# EAGLE board Axion (EAGLE 7.7.0)
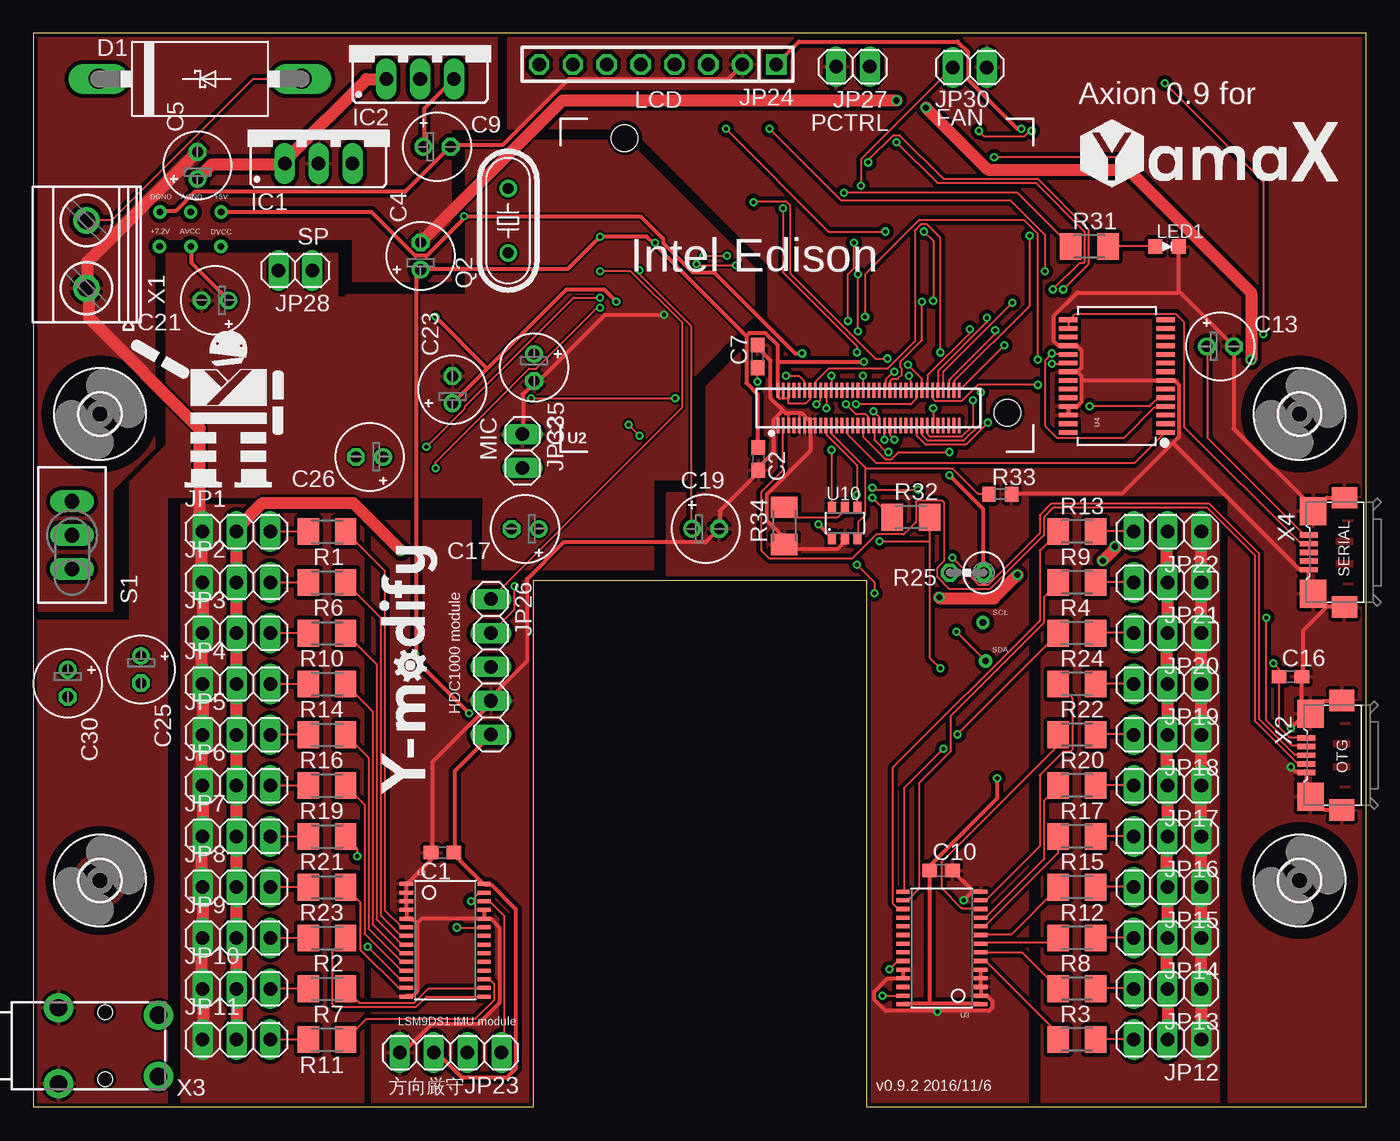
[diagram p1: board, top side]
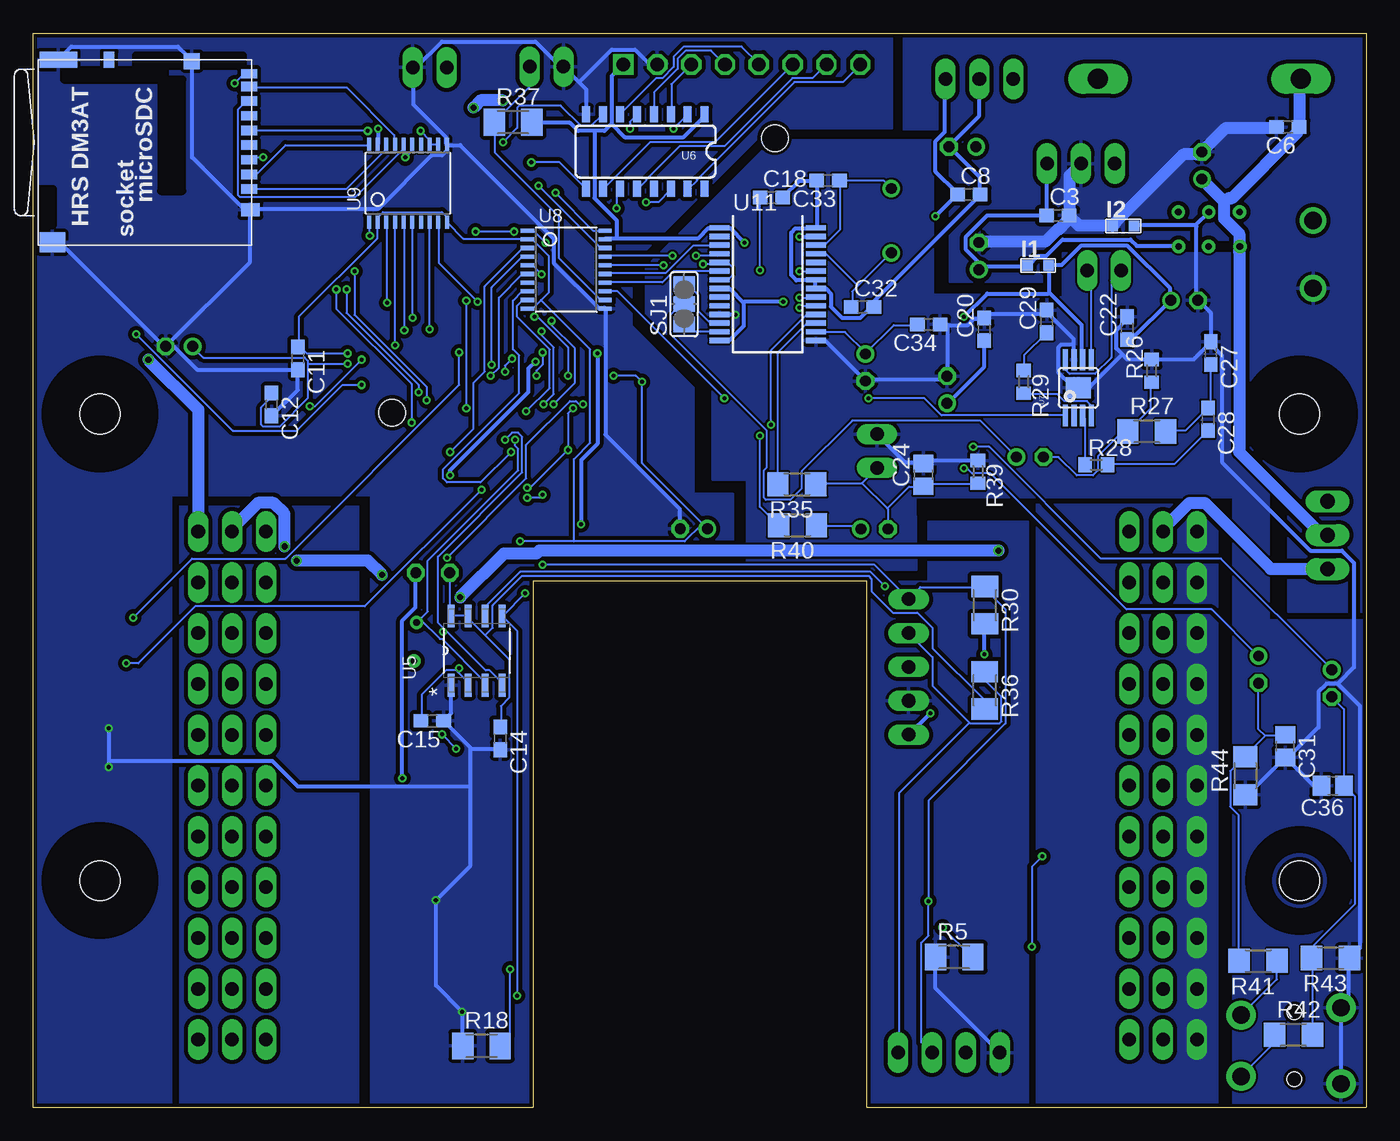
[diagram p2: board, bottom side, seen from below]

Size 100 x 80.55 mm. Coordinates in mm from the lower left corner, seen from the top.
Outline: 100,0 100,80.55 0,80.55 0,0 37.5,0 37.5,39.5 62.5,39.5 62.5,0 100,0
Copper layers (1*16): Top 0.035mm / dielectric 1.5mm / Bottom 0.035mm
Design rules "ssci_SeeedStudio_2layer_DRU_no_angle": minimum track width 6mil, minimum drill 12mil, track to track 6mil, track to pad 6mil, pad to pad 6mil, via to via 6mil, smd to smd 0mil, copper to edge 10mil, drill to drill 10mil, minimum pad ring 10mil, minimum via ring 6mil, stop-mask expansion 2mil, vias tented up to drill 25mil, thermal gap 10mil
Net classes: 1 motorpower: width 0.914 mm, drill 0.457 mm; 2 power: width 0.305 mm, drill 0.152 mm

## Footprints (pad centres in the part's own frame; a part is rotated, then mirrored left to right if it is on the bottom)
C1608 = smd 1.1 x 1: 1 -0.85,0; 2 0.85,0
E2-5 = drill 0.813 pad 1.27: + -1.016,0 | drill 0.813 pad 1.27 octagon: - 1.016,0
C0805 = smd 1.3 x 1.5: 1 -0.85,0; 2 0.85,0
DO201T15 = drill 1.499 long: A 7.62,0; C -7.62,0
3,0 = hole 3: 0,0
1608(1.6*0.8MM) = smd 0.8 x 0.8: P$3 -0.8,0; P$4 0.8,0
78XXS = drill 1.016 long: GND 0,-2.54; IN -2.54,-2.54; OUT 2.54,-2.54
1X03 = drill 1.016 long: 1 -2.54,0; 2 0,0; 3 2.54,0
1X04 = drill 1.016 long: 1 -3.81,0; 2 -1.27,0; 3 1.27,0; 4 3.81,0
1X08 = drill 1.016 square: 1 -8.89,0 | drill 1.016 octagon: 2 -6.35,0; 3 -3.81,0; 4 -1.27,0; 5 1.27,0; 6 3.81,0; 7 6.35,0; 8 8.89,0
DM3AT-SF-PEJ = smd 0.7 x 1.2: 1 0,0.6; 2 -1.1,0.6; 3 -2.2,0.6; 4 -3.3,0.6; 5 -4.4,0.6; 6 -5.5,0.6; 7 -6.6,0.6; 8 -7.7,0.6; CC1 -8.65,0.6 | smd 1.2 x 2.8: CASE1 -9.7,-13.7 | smd 1.5 x 1.9: CASE2 4,-14.15 | smd 1 x 1.4: CASE3 1.55,0.7 | smd 1.2 x 1.2: CASE4 -9.6,-3.7 | smd 1.2 x 0.8: CC2 -9.7,-9.9
1X05 = drill 1.016 long: 1 -5.08,0; 2 -2.54,0; 3 0,0; 4 2.54,0; 5 5.08,0
1X02 = drill 1.016 long: 1 -1.27,0; 2 1.27,0
LED1608 = smd 1.05 x 1.08: A -0.875,0; K 0.875,0
HC49/S = drill 0.813: 1 -2.413,0; 2 2.413,0
M1206 = smd 1.6 x 2: 1 -1.4,0; 2 1.4,0
0309V = drill 0.813 octagon: 1 -1.27,0; 2 1.27,0
R0603 = smd 1 x 1.1: 1 -0.85,0; 2 0.85,0
R1206 = smd 1.6 x 1.803: 1 -1.422,0; 2 1.422,0
TL3XPO = drill 1.1 pad 1.422 long: 1 -2.54,0; 2 0,0; 3 2.54,0
SJ_2 = smd 1.168 x 1.6: 1 -1.524,0; 2 0,0; 3 1.524,0
ROUND-AUTO-0.5 = drill 0.5: TP 0,0
TSSOP28 = smd 0.305 x 0.991: 1 -4.225,-2.918; 2 -3.575,-2.918; 3 -2.925,-2.918; 4 -2.275,-2.918; 5 -1.625,-2.918; 6 -0.975,-2.918; 7 -0.325,-2.918; 8 0.325,-2.918; 9 0.975,-2.918; 10 1.625,-2.918; 11 2.275,-2.918; 12 2.925,-2.918; 13 3.575,-2.918; 14 4.225,-2.918; 15 4.225,2.918; 16 3.575,2.918; 17 2.925,2.918; 18 2.275,2.918; 19 1.625,2.918; 20 0.975,2.918; 21 0.325,2.918; 22 -0.325,2.918; 23 -0.975,2.918; 24 -1.625,2.918; 25 -2.275,2.918; 26 -2.925,2.918; 27 -3.575,2.918; 28 -4.225,2.918
EDISON_DAUGHTER = smd 1.14 x 0.2: 1 1.98,19.17; 2 4.62,19.17; 3 1.98,18.77; 4 4.62,18.77; 5 1.98,18.37; 6 4.62,18.37; 7 1.98,17.97; 8 4.62,17.97; 9 1.98,17.57; 10 4.62,17.57; 11 1.98,17.17; 12 4.62,17.17; 13 1.98,16.77; 14 4.62,16.77; 15 1.98,16.37; 16 4.62,16.37; 17 1.98,15.97; 18 4.62,15.97; 19 1.98,15.57; 20 4.62,15.57; 21 1.98,15.17; 22 4.62,15.17; 23 1.98,14.77; 24 4.62,14.77; 25 1.98,14.37; 26 4.62,14.37; 27 1.98,13.97; 28 4.62,13.97; 29 1.98,13.57; 30 4.62,13.57; 31 1.98,13.17; 32 4.62,13.17; 33 1.98,12.77; 34 4.62,12.77; 35 1.98,12.37; 36 4.62,12.37; 37 1.98,11.97; 38 4.62,11.97; 39 1.98,11.57; 40 4.62,11.57; 41 1.98,11.17; 42 4.62,11.17; 43 1.98,10.77; 44 4.62,10.77; 45 1.98,10.37; 46 4.62,10.37; 47 1.98,9.97; 48 4.62,9.97; 49 1.98,9.57; 50 4.62,9.57; 51 1.98,9.17; 52 4.62,9.17; 53 1.98,8.77; 54 4.62,8.77; 55 1.98,8.37; 56 4.62,8.37; 57 1.98,7.97; 58 4.62,7.97; 59 1.98,7.57; 60 4.62,7.57; 61 1.98,7.17; 62 4.62,7.17; 63 1.98,6.77; 64 4.62,6.77; 65 1.98,6.37; 66 4.62,6.37; 67 1.98,5.97; 68 4.62,5.97; 69 1.98,5.57; 70 4.62,5.57 | hole 2: 23.53,30.67; 2.93,1.98
SSOP28DB = smd 0.348 x 1.397: 1 -4.225,-3.656; 2 -3.575,-3.656; 3 -2.925,-3.656; 4 -2.275,-3.656; 5 -1.625,-3.656; 6 -0.975,-3.656; 7 -0.325,-3.656; 8 0.325,-3.656; 9 0.975,-3.656; 10 1.625,-3.656; 11 2.275,-3.656; 12 2.925,-3.656; 13 3.575,-3.656; 14 4.225,-3.656; 15 4.225,3.656; 16 3.575,3.656; 17 2.925,3.656; 18 2.275,3.656; 19 1.625,3.656; 20 0.975,3.656; 21 0.325,3.656; 22 -0.325,3.656; 23 -0.975,3.656; 24 -1.625,3.656; 25 -2.275,3.656; 26 -2.925,3.656; 27 -3.575,3.656; 28 -4.225,3.656
SOIC127P600X175-8N = smd 1.702 x 0.533: 1 -2.591,1.905; 2 -2.591,0.635; 3 -2.591,-0.635; 4 -2.591,-1.905; 5 2.591,-1.905; 6 2.591,-0.635; 7 2.591,0.635; 8 2.591,1.905
SO016 = smd 0.6 x 1.2: 1 -4.445,-2.8; 2 -3.175,-2.8; 3 -1.905,-2.8; 4 -0.635,-2.8; 5 0.635,-2.8; 6 1.905,-2.8; 7 3.175,-2.8; 8 4.445,-2.8; 9 4.445,2.8; 10 3.175,2.8; 11 1.905,2.8; 12 0.635,2.8; 13 -0.635,2.8; 14 -1.905,2.8; 15 -3.175,2.8; 16 -4.445,2.8
POWER-SOP8 = smd 0.4 x 1.6: 1 -0.975,-2.1; 2 -0.325,-2.1; 3 0.325,-2.1; 4 0.975,-2.1; 5 0.975,2.1; 6 0.325,2.1; 7 -0.325,2.1; 8 -0.975,2.1 | smd 1.89 x 1.57: 9 0,0
TSSOP20 = smd 0.305 x 0.991: 1 -2.925,-2.918; 2 -2.275,-2.918; 3 -1.625,-2.918; 4 -0.975,-2.918; 5 -0.325,-2.918; 6 0.325,-2.918; 7 0.975,-2.918; 8 1.625,-2.918; 9 2.275,-2.918; 10 2.925,-2.918; 11 2.925,2.918; 12 2.275,2.918; 13 1.625,2.918; 14 0.975,2.918; 15 0.325,2.918; 16 -0.325,2.918; 17 -0.975,2.918; 18 -1.625,2.918; 19 -2.275,2.918; 20 -2.925,2.918
SOT23-6 = smd 0.6 x 0.9: 1 -0.95,-1.15; 2 0,-1.15; 3 0.95,-1.15; 4 0.95,1.15; 5 0,1.15; 6 -0.95,1.15
SSOP28 = smd 0.4 x 1.5: 1 -4.225,-3.625; 2 -3.575,-3.625; 3 -2.925,-3.625; 4 -2.275,-3.625; 5 -1.625,-3.625; 6 -0.975,-3.625; 7 -0.325,-3.625; 8 0.325,-3.625; 9 0.975,-3.625; 10 1.625,-3.625; 11 2.275,-3.625; 12 2.925,-3.625; 13 3.575,-3.625; 14 4.225,-3.625; 15 4.225,3.625; 16 3.575,3.625; 17 2.925,3.625; 18 2.275,3.625; 19 1.625,3.625; 20 0.975,3.625; 21 0.325,3.625; 22 -0.325,3.625; 23 -0.975,3.625; 24 -1.625,3.625; 25 -2.275,3.625; 26 -2.925,3.625; 27 -3.575,3.625; 28 -4.225,3.625
MKDSN1,5/2-5,08 = drill 1.3 pad 2: 1 -2.561,0.025; 2 2.519,0.025
ZX62R-AB-5P = smd 1.35 x 0.4: 1 2.675,-1.3; 2 2.675,-0.65; 3 2.675,0; 4 2.675,0.65; 5 2.675,1.3 | smd 1.9 x 1.6: S1 0,-4.1; S2 0,4.1 | smd 2 x 2.1: S3 2.35,3.1; S4 2.35,-3.1
ST-005-G = drill 1.3 pad 2.184: 1 -2.85,-6.1; 2 -2.3,-13.6; 3 2.3,-13.6; 4 2.85,-6.1 | hole 1.1: -2.5,-9.6; 2.5,-9.6
ZX62R-B-5P = smd 1.35 x 0.4: 1 2.675,-1.3; 2 2.675,-0.65; 3 2.675,0; 4 2.675,0.65; 5 2.675,1.3 | smd 1.9 x 1.6: S1 0,-4.1; S2 0,4.1 | smd 2 x 2.1: S3 2.35,3.1; S4 2.35,-3.1

## Placement (x,y rotation side)
C1  0.1u  [C1608]  30.7,19.1 180 top
C2  0.1u  [C1608]  54.39,48.63 270 top
C3  0.1u  [C1608]  23.13,66.89 0 bottom
C4  33u  [E2-5]  29.06,63.84 90 top
C5  33u  [E2-5]  12.32,70.64 90 top
C6  0.1u  [C1608]  5.88,73.52 180 bottom
C7  0.1u  [C1608]  54.34,56.32 90 top
C8  0.1u  [C1608]  29.81,68.45 0 bottom
C9  33u  [E2-5]  30.29,72.05 0 top
C10  0.1u  [C1608]  68.11,17.75 0 top
C11  0.1u  [C1608]  80.15,56.17 270 bottom
C12  0.1u  [C1608]  82.13,52.72 270 bottom
C13  10u  [E2-5]  89.06,57.07 0 top
C14  0.1u  [C1608]  64.97,27.67 270 bottom
C15  0.1u  [C1608]  70.07,28.99 180 bottom
C16  0.1u  [C1608]  94.32,32.29 0 top
C17  1u  [E2-5]  36.9,43.38 180 top
C18  0.1u  [C1608]  44.62,68.24 0 bottom
C19  10u  [E2-5]  50.44,43.4 0 top
C20  0.1u  [C1608]  28.65,58.36 90 bottom
C21  10u  [E2-5]  13.63,60.53 180 top
C22  0.1u  [C1608]  17.93,58.45 90 bottom
C23  10u  [E2-5]  31.45,53.82 90 top
C24  220p  [C0805]  33.22,47.43 90 bottom
C25  1u  [E2-5]  8.08,32.83 270 top
C26  10u  [E2-5]  25.23,48.78 180 top
C27  0.022u  [C1608]  11.66,56.57 270 bottom
C28  0.01u  [C1608]  11.87,51.6 270 bottom
C29  0.01u  [C1608]  23.96,58.94 90 bottom
C30  1u  [E2-5]  2.58,31.8 270 top
C31  220p  [C0805]  6.08,27.09 270 bottom
C32  22p  [C1608]  37.78,60.02 0 bottom
C33  22p  [C1608]  40.37,69.52 180 bottom
C34  0.1u  [C1608]  32.82,58.72 180 bottom
C35  10u  [E2-5]  37.57,55.49 270 top
C36  220p  [C0805]  2.51,24.12 180 bottom
D1  45V10A  [DO201T15]  12.51,77.13 0 top
H1  MOUNT-HOLE3.0  [3,0]  5,52 0 top
H2  MOUNT-HOLE3.0  [3,0]  5,17 0 top
H3  MOUNT-HOLE3.0  [3,0]  95,17 0 top
H4  MOUNT-HOLE3.0  [3,0]  95,52 0 top
I1  [1608(1.6*0.8MM)]  24.61,63.13 0 bottom
I2  [1608(1.6*0.8MM)]  18.22,66.1 0 bottom
IC1  3.3V  [78XXS]  21.4,73.32 0 top
IC2  5V  [78XXS]  29.02,79.67 0 top
JP1  [1X03]  15.24,43.18 0 top
JP2  [1X03]  15.24,39.37 0 top
JP3  [1X03]  15.24,35.56 0 top
JP4  [1X03]  15.24,31.75 0 top
JP5  [1X03]  15.24,27.94 0 top
JP6  [1X03]  15.24,24.13 0 top
JP7  [1X03]  15.24,20.32 0 top
JP8  [1X03]  15.24,16.51 0 top
JP9  [1X03]  15.24,12.7 0 top
JP10  [1X03]  15.24,8.89 0 top
JP11  [1X03]  15.24,5.08 0 top
JP12  [1X03]  85.09,5.08 180 top
JP13  [1X03]  85.09,8.89 180 top
JP14  [1X03]  85.09,12.7 180 top
JP15  [1X03]  85.09,16.51 180 top
JP16  [1X03]  85.09,20.32 180 top
JP17  [1X03]  85.09,24.13 180 top
JP18  [1X03]  85.09,27.94 180 top
JP19  [1X03]  85.09,31.75 180 top
JP20  [1X03]  85.09,35.56 180 top
JP21  [1X03]  85.09,39.37 180 top
JP22  [1X03]  85.09,43.18 180 top
JP23  LSM9DS1 IMU module  [1X04]  31.31,4.1 180 top
JP24  LCD  [1X08]  46.84,78.22 180 top
JP25  DM3AT-ST-PEJ  [DM3AT-SF-PEJ]  84.42,68.87 270 bottom
JP26  HDC1000 module  [1X05]  34.33,33.03 270 top
JP27  PCTRL  [1X02]  61.5,78.05 180 top
JP28  SP  [1X02]  19.66,62.76 180 top
JP30  FAN  [1X02]  70.26,77.99 0 top
JP32  MIC  [1X02]  36.7,49.23 270 top
LED1  LED1608  [LED1608]  85.06,64.55 0 top
Q2  12.288Mhz  [HC49/S]  35.62,66.5 90 top
R1  220  [M1206]  22.03,43.18 180 top
R2  220  [M1206]  22.03,12.7 180 top
R3  220  [M1206]  78.3,5.08 0 top
R4  220  [M1206]  78.3,35.56 0 top
R5  10k  [M1206]  30.91,11.26 0 bottom
R6  220  [M1206]  22.03,39.37 180 top
R7  220  [M1206]  22.03,8.89 180 top
R8  220  [M1206]  78.3,8.89 0 top
R9  220  [M1206]  78.3,39.37 0 top
R10  220  [M1206]  22.03,35.56 180 top
R11  220  [M1206]  22.03,5.08 180 top
R12  220  [M1206]  78.3,12.7 0 top
R13  220  [M1206]  78.3,43.18 0 top
R14  220  [M1206]  22.03,31.75 180 top
R15  220  [M1206]  78.3,16.51 0 top
R16  220  [M1206]  22.03,27.94 180 top
R17  220  [M1206]  78.3,20.32 0 top
R18  10k  [M1206]  66.38,4.61 0 bottom
R19  220  [M1206]  22.03,24.13 180 top
R20  220  [M1206]  78.3,24.13 0 top
R21  220  [M1206]  22.03,20.32 180 top
R22  220  [M1206]  78.3,27.94 0 top
R23  220  [M1206]  22.03,16.51 180 top
R24  220  [M1206]  78.3,31.75 0 top
R25  200k  [0309V]  70.03,40.09 180 top
R26  47k  [R0603]  16.09,55.23 90 bottom
R27  2.2k  [R1206]  16.46,50.69 0 bottom
R28  100k  [R0603]  20.24,48.19 0 bottom
R29  100k  [R0603]  25.69,54.41 270 bottom
R30  10k  [M1206]  28.61,37.67 270 bottom
R31  220  [M1206]  79.24,64.55 0 top
R32  10k  [M1206]  65.85,44.26 0 top
R33  100k  [R0603]  72.54,45.99 0 top
R34  576  [M1206]  56.35,43.61 90 top
R35  680  [R1206]  42.71,46.73 180 bottom
R36  10k  [M1206]  28.62,31.26 270 bottom
R37  10k  [M1206]  64.01,73.89 0 bottom
R39  47k  [R0603]  29.13,47.66 270 bottom
R40  330  [R1206]  42.66,43.66 180 bottom
R41  5.6k  [R1206]  8.11,10.98 180 bottom
R42  5.6k  [R1206]  5.45,5.43 0 bottom
R43  5.6k  [R1206]  2.68,11.2 180 bottom
R44  5.6k  [R1206]  9.07,24.87 90 bottom
S1  TL32PO  [TL3XPO]  2.91,42.91 90 top
SJ1  [SJ_2]  51.17,60.24 90 bottom
TP1  TESTPAD-R-AUTO-0.5  [ROUND-AUTO-0.5]  9.5,67.14 0 top
TP2  TESTPAD-R-AUTO-0.5  [ROUND-AUTO-0.5]  11.81,67.14 0 top
TP3  TESTPAD-R-AUTO-0.5  [ROUND-AUTO-0.5]  14.09,67.14 0 top
TP4  TESTPAD-R-AUTO-0.5  [ROUND-AUTO-0.5]  9.48,64.56 0 top
TP5  TESTPAD-R-AUTO-0.5  [ROUND-AUTO-0.5]  11.83,64.56 0 top
TP6  TESTPAD-R-AUTO-0.5  [ROUND-AUTO-0.5]  14.08,64.56 0 top
TP7  TESTPAD-R-AUTO-0.5  [ROUND-AUTO-0.5]  71.46,33.48 0 top
TP8  TESTPAD-R-AUTO-0.5  [ROUND-AUTO-0.5]  71.24,36.37 0 top
U1  [TSSOP28]  30.91,12.53 270 top
U2  Intel Edison  [EDISON_DAUGHTER]  75.04,49.16 90 top
U3  [TSSOP28]  68.16,11.95 90 top
U4  FT232RLSSOP  [SSOP28DB]  81.28,54.84 90 top
U5  PCA9306D  [SOIC127P600X175-8N]  66.74,34.25 90 bottom
U6  74HC4050  [SO016]  54.08,71.68 180 bottom
U7  TPA2005D1DGN  [POWER-SOP8]  21.59,53.98 0 bottom
U8  [TSSOP20]  60.02,62.83 270 bottom
U9  [TSSOP20]  71.89,69.3 0 bottom
U10  MIC2039  [SOT23-6]  60.88,43.83 0 top
U11  WM8731  [SSOP28]  44.91,61.75 270 bottom
U$1  Y-MODIFY  [Y-MODIFY]  30.3,23.51 90 top
U$2  YAMAX  [YAMAX]  78.57,68.89 0 top
U$4  MON  [MON]  11.17,46.49 0 top
X1  [MKDSN1,5/2-5,08]  4.01,63.99 90 top
X2  ZX62R-AB-5P  [ZX62R-AB-5P]  98.17,26.4 180 top
X3  ST-005-G  [ST-005-G]  -4.21,4.62 90 top
X4  ZX62R-B-5P  [ZX62R-B-5P]  98.37,41.62 180 top

## Tracks (layer width: path | path; a pad name or v marks a point on that pad's centre or on a via)
1A
  Bottom 0.152: U6.3 52.12,74.52 52.12,76.73 50.67,78.18 JP24.3
1P0
  Top 0.152: U1.6 27.96,13.56 27.58,13.56 26.36,14.78 26.36,40.23 23.47,43.13 R1.1
1P1
  Top 0.152: U1.7 27.96,12.88 27.58,12.88 26.06,14.4 26.06,36.73 23.47,39.32 R6.1
1P2
  Top 0.152: U1.8 27.96,12.27 27.58,12.27 25.76,14.1 25.76,33.22 23.47,35.51 R10.1
1P3
  Top 0.152: U1.9 27.96,11.58 27.58,11.58 25.45,13.72 25.45,29.72 23.47,31.7 R14.1
1P4
  Top 0.152: U1.10 27.96,10.97 27.58,10.97 25.15,13.41 25.15,26.21 23.47,27.89 R16.1
1P5
  Top 0.152: U1.11 27.96,10.29 27.58,10.29 24.84,13.03 24.84,22.71 23.47,24.08 R19.1
1P6  (via drill 0.3)
  Top 0.152: v25.07,12.04 27.43,9.68 27.96,9.68 U1.12 | v24.31,18.82 24.31,19.43 23.47,20.27 R21.1
  Bottom 0.152: v25.07,12.04 25.07,18.06 v24.31,18.82
1P7
  Top 0.152: U1.13 27.96,8.99 27.36,8.99 24.54,11.81 24.54,15.39 23.47,16.46 R23.1
1P8
  Top 0.152: U1.15 33.76,8.31 29.49,8.31 28.73,7.54 22.63,7.54 22.4,7.77 22.4,11.66 23.39,12.65 R2.1
1P9
  Top 0.152: U1.16 33.76,8.91 29.64,8.91 28.57,7.85 24.46,7.85 23.47,8.84 R7.1
1P10
  Top 0.152: U1.17 34.21,9.6 34.59,9.22 34.59,8.08 33.15,6.63 24.99,6.63 23.47,5.11 R11.1
1V8I2S_BCK  (via drill 0.3)
  Top 0.152: v65.68,54.86 65.68,54.63 65.84,54.48 65.84,53.8 U2.52
  Bottom 0.152: v65.68,54.86 65.08,55.47 65.08,60.73 63.32,62.48 62.94,62.48 U8.6
1V8I2S_LRCK  (via drill 0.3)
  Top 0.152: v61.87,58.22 v61.87,62.48 | v61.72,52.73 65.84,52.73 66.22,53.11 66.22,53.72 U2.54
  Bottom 0.152: v61.87,62.48 62.48,63.09 62.87,63.09 U8.5 | v61.87,58.22 61.87,57.91 60.96,57 60.96,53.49 v61.72,52.73
1V8I2S_TXD  (via drill 0.3)
  Top 0.152: v65.61,55.7 66.67,54.63 66.67,53.8 U2.56
  Bottom 0.152: v65.61,55.7 65.61,61.49 63.32,63.78 62.94,63.78 U8.4
1V8PWMFAN  (via drill 0.3)
  Top 0.152: v68.73,49.15 64.92,49.15 64.39,48.62 63.93,48.62 62.26,50.29 62.26,51.13 U2.33
  Bottom 0.152: v68.73,49.15 66.98,50.9 66.98,54.33 66.14,55.17 66.14,61.57 63.32,64.39 62.94,64.39 U8.3
1V8PWMLED  (via drill 0.3)
  Top 0.152: v61.57,64.85 61.57,62.94 61.11,62.48 v61.11,58.98 | v60.96,52.73 61.72,51.97 62.48,51.97 62.64,51.82 62.64,51.21 U2.35
  Bottom 0.152: v61.57,64.85 62.41,65.68 62.87,65.68 U8.1 | v61.11,58.98 61.11,58.67 59.36,56.92 59.36,54.33 v60.96,52.73
1V8PWRCTRL  (via drill 0.3)
  Top 0.152: v63.02,52.2 63.48,51.74 63.48,51.21 U2.39
  Bottom 0.152: v63.02,52.2 61.27,53.95 61.27,56.84 63.7,59.28 63.7,60.12 63.32,60.5 62.94,60.5 U8.9
1V8SCL  (via drill 0.3)
  Top 0.152: v63.86,50.06 63.86,51.13 U2.41
  Bottom 0.152: v63.86,50.06 63.86,49.61 63.63,49.38 63.63,47.78 70.41,41 70.41,37.19 71.17,36.42 TP8.TP 70.94,36.58 69.49,35.13 69.34,35.13 66.14,31.93 66.14,31.7 U5.3
1V8SDA  (via drill 0.3)
  Top 0.152: v64.62,50.06 64.31,50.37 64.31,51.13 U2.43 | v69.27,35.66 71.4,33.53 TP7.TP
  Bottom 0.152: v64.62,50.06 64.08,50.6 63.63,50.6 63.32,50.29 63.32,47.62 69.65,41.3 69.65,36.35 69.11,35.81 | 69.11,35.81 66.06,32.77 65.76,32.77 64.85,31.85 64.85,31.7 U5.4 | 69.11,35.81 v69.27,35.66
1V8SHUTDOWN  (via drill 0.3)
  Top 0.152: v64.16,49.15 64.01,49.15 63.09,50.06 63.09,51.13 U2.37
  Bottom 0.152: v64.16,49.15 66.45,46.86 68.96,46.86 69.27,47.17 69.27,47.85 63.55,53.57 63.55,56.39 64.01,56.84 64.01,60.5 63.32,61.19 U8.8
1Y  (via drill 0.3)
  Top 0.152: v67.51,52.43 67.51,51.21 U2.59 | v67.51,60.5 67.51,65 v66.83,65.68 | v63.93,65.68 59.66,65.68 v51.97,73.38
  Bottom 0.152: v67.51,60.5 v67.51,52.43 | v63.93,65.68 v66.83,65.68 | v51.97,73.38 50.9,74.45 U6.2
2P0
  Top 0.152: U3.6 71.09,10.97 71.48,10.97 76.89,5.56 76.89,5.11 R3.1
2P1
  Top 0.152: U3.7 71.09,11.58 74.22,11.58 76.89,8.91 R8.1
2P2
  Top 0.152: U3.8 71.09,12.34 76.58,12.34 76.89,12.65 R12.1
2P3
  Top 0.152: U3.9 71.09,12.95 73.38,12.95 76.89,16.46 R15.1
2P4
  Top 0.152: U3.10 71.09,13.64 71.48,13.64 76.89,19.05 76.89,20.27 R17.1
2P5
  Top 0.152: U3.11 71.09,14.25 71.48,14.25 75.82,18.59 75.82,23.01 76.89,24.08 R20.1
2P6
  Top 0.152: U3.12 71.02,14.94 69.65,14.94 68.12,16.46 68.12,18.36 76.89,27.13 76.89,27.89 R22.1
2P7
  Top 0.152: U3.13 71.09,15.54 71.48,15.54 75.51,19.58 75.51,24.92 77.27,26.67 77.8,26.67 77.95,26.82 77.95,30.71 76.96,31.7 R24.1
2P8  (via drill 0.3)
  Top 0.152: v68.28,26.9 65.3,23.93 65.3,16.23 U3.15 | v69.34,27.96 76.89,35.51 R4.1
  Bottom 0.152: v69.34,27.96 v68.28,26.9
2P9
  Top 0.152: U3.16 65.3,15.54 65.61,15.54 66.45,16.38 66.45,24.31 68.81,26.67 68.81,29.34 75.82,36.35 75.82,38.25 76.89,39.32 R9.1
2P10
  Top 0.152: U3.17 65.23,14.94 64.85,14.94 64.47,15.32 64.47,25.45 75.51,36.5 75.51,41.76 76.89,43.13 R13.1
3V3SCL  (via drill 0.3)
  Top 0.152: JP23.1 35.36,4.34 35.36,14.33 34.29,15.39 33.83,15.39 U1.26 | v36.12,39.09 36.12,37.34 34.37,35.59 JP26.2
  Bottom 0.152: v36.12,39.09 37.19,40.16 63.48,40.16 66.06,37.57 66.06,36.88 U5.6 | 29.76,28.84 32.54,31.62 32.54,33.76 34.29,35.51 JP26.2 | 29.76,28.84 29.72,28.8 27.51,28.8 27.36,28.96 27.36,30.79 28.57,32 28.57,32.61 R36.1 | 29.76,28.84 35.05,23.55 35.05,4.12 JP23.1
3V3SDA  (via drill 0.3)
  Top 0.152: v63.7,8.38 65.23,8.38 U3.27 | v32.84,15.47 33.45,16.08 33.76,16.08 U1.27 | v42.52,62.71 44.81,62.71 48.69,58.83 48.69,52.5 34.37,38.18 JP26.1 | v63.09,38.56 63.09,39.4 v61.8,40.69
  Bottom 0.152: v63.7,8.38 63.7,35.74 64.77,36.8 U5.5 64.77,36.88 v63.09,38.56 | JP23.2 32.61,4.12 33.38,4.88 33.38,12.34 32.84,12.88 v32.84,15.47 32.84,23.01 27.05,28.8 27.05,37.34 28.65,38.94 R30.1 28.65,39.01 33.45,39.01 34.29,38.18 JP26.1 34.37,38.18 36.88,40.69 v61.8,40.69 | v42.52,62.71 41.3,62.71 U11.23
+1V8  (via drill 0.3)
  Top 0.152: 76.43,56.46 77.57,56.46 U4.19 | 76.43,56.46 76.35,56.46 75.89,56.01 75.89,51.13 76.81,50.22 81.84,50.22 84.12,52.5 84.89,52.5 U4.4 | v76.43,56.54 76.43,56.46 | 67.28,42.44 67.28,33.68 v68.05,32.92 | 67.28,42.44 67.28,44.2 R32.2 | v54.33,54.41 C7.1 | v45.49,62.79 45.49,62.48 49.38,58.6 49.38,43.43 C19.+ | v56.46,54.86 57.45,54.86 57.84,54.48 57.84,53.8 U2.12 | v63.48,42.44 67.28,42.44
  Bottom 0.152: 61.91,60.54 61.34,61.11 61.34,63.86 62.56,65.08 62.87,65.08 U8.2 62.94,65.15 67.74,65.15 68.96,66.37 U9.10 69.04,66.45 69.04,66.83 69.34,67.13 73.76,67.13 74.14,66.75 74.14,66.45 U9.2 74.22,66.37 74.22,65.15 80.09,59.28 80.09,57.07 C11.1 80.01,57.07 79.48,56.54 v76.43,56.54 | 61.91,60.54 62.48,59.97 62.87,59.97 U8.10 | 68.24,32.73 67.44,31.93 67.44,31.7 U5.2 | 68.24,32.73 68.28,32.77 69.04,32.77 70.87,30.94 70.87,29.03 C15.2 | 68.24,32.73 v68.05,32.92 | v45.49,62.79 45.49,68.2 C18.1 | v56.46,54.86 54.79,54.86 v54.33,54.41 54.33,48.31 49.45,43.43 C19.+ 49.84,43.74 51.13,42.44 59.44,42.44 | 59.44,42.44 v63.48,42.44 | 61.91,60.54 58.22,56.84 58.22,49.84 59.44,48.62 59.44,42.44
+3V3  (via drill 0.3)
  Top 0.152: U2.14 58.27,53.1 57.94,52.77 56.67,52.77 U2.6 56.67,53.13 56.27,53.13 | 56.27,53.13 U2.4 | U2.4 | U2.4 56.27,53.13 | 56.27,53.13 55.96,53.13 55.87,53.22 U2.2
  Top 0.305: v32.69,29.57 28.65,33.6 v28.65,33.98 28.73,34.06 28.73,62.48 28.96,62.71 C4.+ 29.11,62.87 40.08,62.87 v42.52,65.3 46.02,65.3 46.56,64.77 | JP26.5 34.29,27.89 31.62,25.22 31.62,19.2 C1.1 31.47,19.05 33.76,16.76 U1.28 33.91,16.69 34.37,16.69 36.2,14.86 36.2,2.9 35.51,2.21 32.16,2.21 30.33,4.04 30.1,4.04 JP23.3 | 67.28,7.77 71.02,7.77 U3.1 | 67.28,7.77 65.3,7.77 U3.28 | 67.28,7.77 67.28,17.75 C10.1 67.36,17.83 67.36,18.21 72.31,23.16 v72.31,24.69 | v74.14,73.38 73.84,73.38 70.1,77.11 70.1,79.17 69.34,79.93 57.45,79.93 55.78,78.26 JP24.1 | 53.49,57.84 53.49,54.33 54.33,53.49 54.33,49.53 C2.1 | 53.49,57.84 53.72,58.06 54.94,58.06 55.85,57.15 55.85,55.93 | 55.85,55.93 55.85,53.8 U2.2 | 53.49,57.84 46.56,64.77 | v46.63,64.85 46.56,64.77 | v68.73,47.4 71.25,44.88 71.25,40.16 R25.1 | 55.85,55.93 v62.33,55.93
  Bottom 0.305: v28.65,33.98 28.65,36.27 R30.2 | v32.69,29.57 34.29,27.96 JP26.5 | v72.31,24.69 72.31,36.5 71.32,37.49 71.32,40.08 R25.1 | 56.24,65.15 50.14,65.15 49.38,65.91 48.54,65.91 U11.1 48.39,65.91 47.7,65.91 v46.63,64.85 | 56.24,65.15 57.07,65.15 U8.19 | v74.14,73.38 74.14,72.24 U9.19 | 56.62,73.76 55.63,72.77 51.21,72.77 49.68,74.3 49.68,74.45 U6.1 | 56.62,73.76 56.62,77.34 55.78,78.18 JP24.1 | 57.91,73.23 57.15,73.23 56.62,73.76 | 57.91,73.23 59.13,73.23 59.74,73.84 62.56,73.84 R37.2 | 56.24,65.15 56.24,66.52 57.91,68.2 57.91,73.23 | IC1.OUT 24,70.71 24,66.9 C3.1 24.16,66.9 28.42,66.9 30.02,65.3 30.02,64.31 28.88,63.17 C4.+ 29.03,62.87 28.8,63.09 25.45,63.09 I1.P$3 25.3,63.17 24.61,63.86 24,63.86 22.78,65.08 17.68,65.08 17.22,64.62 14.1,64.62 TP6.TP | v42.52,65.3 41.3,65.3 U11.27 | v68.73,47.4 68.73,47.78 62.87,53.65 62.87,55.4 v62.33,55.93
+5V  (via drill 0.3)
  Top 0.305: IC2.OUT 29.34,74.91 29.34,72.08 C9.+ | v58.9,43.74 59.89,42.75 U10.1 | v57.68,56.54 57.15,56.54 51.05,62.64 49.45,62.64 47.24,64.85 47.24,65.15 45.57,66.83 v32.31,66.83 32.38,66.75 29.49,63.86 28.65,63.86 25.38,67.13 TP3.TP
  Bottom 0.305: v58.9,43.74 58.9,48.54 57.68,49.76 v57.68,56.54 | v32.31,66.83 30.71,68.43 C8.1 30.71,68.58 32.31,70.18 32.31,72.47 31.62,73.15 31.62,77.11 IC2.OUT
AGND  (via drill 0.3)
  Top 0.305: v47.32,59.44 42.9,59.44 37.95,54.48 37.57,54.48 C35.- 37.57,54.33 36.73,53.49 36.73,50.52 JP32.1
  Bottom 0.305: C36.2 3.43,24.16 3.96,24.16 6.02,26.21 C31.2 | R44.1 9.07,23.47 8.84,23.47 6.17,26.14 C31.2 | X3.1 1.91,1.83 1.91,7.39 X3.4 1.83,7.54 1.29,8.08 1.29,11.12 R43.1 1.14,11.28 0.46,11.96 0.46,30.1 2.13,31.77 | 2.13,31.77 2.97,31.77 3.58,31.17 3.58,28.5 5.87,26.21 C31.2 | R39.1 29.18,48.54 32.92,48.54 33.15,48.31 C24.2 33.3,48.39 34.59,48.39 JP32.1 | U11.15 41.22,57.45 40.54,57.45 37.57,54.48 C35.- 37.49,54.56 31.77,54.56 31.55,54.79 C23.- 31.39,54.86 31.39,58.67 | v47.32,59.44 48.46,59.44 U11.11 | 21.95,57.23 21.95,56.08 U7.7 | 21.95,57.23 21.95,57.61 23.93,59.59 23.93,59.74 C29.2 24,59.51 28.35,59.51 28.57,59.28 C20.2 28.65,59.13 29.41,59.13 29.87,58.67 31.39,58.67 | 31.39,58.67 31.93,58.67 C34.1 | 12.8,66.14 17.37,66.14 I2.P$4 | 12.8,66.14 TP2.TP | C27.1 11.66,59.59 12.57,60.5 C21.- 12.72,60.58 12.72,66.06 12.8,66.14 | C27.1 11.73,57.3 12.95,56.08 16.08,56.08 R26.2 16.23,56.08 17.91,56.08 18.29,56.46 | 18.29,56.46 18.75,56.92 18.75,58.29 17.98,59.05 17.98,59.28 C22.2 | 18.29,56.46 20.73,54.03 21.57,54.03 U7.9 21.72,54.03 22.02,54.03 23.09,55.09 23.09,57 22.86,57.23 21.95,57.23 | 2.13,31.77 0.91,32.99 0.91,40.84 1.83,41.76 4.19,41.76 10.82,48.39 10.82,56.39 11.66,57.23 C27.1
  pour Top: 0,0 0,36.52 7.26,36.52 7.26,46.91 10.02,49.68 10.02,64.04 22.81,64.04 22.81,60.75 23.5,60.75 23.5,60.93 32.48,60.93 32.48,72.52 44.58,72.52 44.58,72.51 54.08,63 54.08,59.36 49.07,54.35 49.07,47.08 46.48,47.08 46.48,40.33 33.69,40.33 33.79,45.77 10.01,45.77 10.01,0
  pour Bottom: 0,0 0,36.52 7.26,36.52 7.26,46.91 10.02,49.68 10.02,64.04 22.81,64.04 22.81,60.75 23.5,60.75 23.5,60.93 32.48,60.93 32.48,72.52 44.58,72.52 44.58,72.51 54.08,63 54.08,59.36 49.07,54.35 49.07,47.08 46.48,47.08 46.48,40.33 33.69,40.33 33.79,45.77 10.01,45.77 10.01,0
AOUTL
  Bottom 0.152: U11.12 49.23,58.83 50.14,59.74 50.14,60.96 50.9,61.72 51.13,61.72 SJ1.3
AOUTR
  Bottom 0.152: SJ1.1 50.67,58.22 48.54,58.22 U11.13
AVCC  (via drill 0.3)
  Top 0.305: TP5.TP 11.89,64.54 11.89,63.32 14.63,60.58 C21.+ | v43.74,60.43 42.82,61.34 40.01,61.34 34.06,55.4 | 34.06,55.4 31.47,52.81 C23.+ | 34.06,55.4 v30.18,59.28
  Bottom 0.305: 23.77,61.11 23.77,63.09 I1.P$4 23.7,63.17 22.86,63.17 21.41,64.62 17.91,64.62 14.71,61.42 14.71,60.66 C21.+ 14.71,60.5 17.6,57.61 17.91,57.61 C22.1 | 23.77,61.11 21.34,58.67 21.34,56.08 U7.6 | 46.71,60.35 46.71,58.6 47.78,57.53 48.46,57.53 U11.14 | 46.71,60.35 47.78,61.42 48.46,61.42 U11.8 | C20.1 28.65,55.55 31.39,52.81 C23.+ | v43.74,60.43 46.63,60.43 46.71,60.35 | v30.18,59.28 28.42,61.04 23.85,61.04 23.77,61.11
DGND  (via drill 0.3)
  Top 0.152: U2.1 55.87,51.91 56.03,52.07 | U2.5 56.67,52.04 56.68,52.05 | U2.9 57.47,52.02 57.45,52.05 | U2.11 57.87,51.8 57.92,51.8 | U2.15 58.67,51.61 58.12,51.61
  Top 0.305: X4.S1 97.08,45.72 96.09,44.73 X4.S4 96.09,44.88 90.07,50.9 90.07,56.92 C13.- 85.95,61.19 | 85.95,61.19 85.95,64.54 LED1.K | 70.48,16.23 71.02,16.23 U3.14 | 70.48,16.23 C10.2 | U3.24 65.23,10.29 65.23,9.68 U3.25 65.08,9.68 64.08,9.68 63.09,8.69 63.09,8.08 63.93,7.24 67.82,7.24 | U3.5 71.09,10.29 71.09,9.83 U3.4 71.09,9.6 71.09,9.14 U3.3 71.09,8.99 71.09,8.38 U3.2 71.25,8.38 71.55,8.38 71.93,8 71.93,7.47 71.7,7.24 67.82,7.24 | v67.82,7.16 67.82,7.24 | v69.8,15.54 70.48,16.23 | X2.S2 98.15,22.33 96.85,22.33 95.94,23.24 X2.S3 95.78,23.32 95.56,23.55 95.56,25.07 X2.5 95.4,25.22 94.64,25.22 v94.34,25.53 | X2.S4 95.78,29.57 95.17,30.18 95.17,32.23 C16.2 95.25,32.38 95.25,35.74 97,37.49 X4.S3 | X2.S1 98.15,30.48 96.85,30.48 95.94,29.57 X2.S4 | X4.S3 96.01,38.56 95.71,38.86 X4.5 95.56,40.39 94.94,40.39 85.5,49.84 | X4.S2 98.3,37.57 97.08,37.57 96.16,38.48 X4.S3 | v94.34,28.42 95.56,29.64 X2.S4 | U4.26 77.65,51.97 77.65,52.5 U4.25 77.8,52.5 78.26,52.5 78.64,52.88 78.64,54.48 | 78.33,55.17 U4.21 | 78.33,55.17 78.64,55.47 78.64,56.77 78.33,57.07 77.65,57.07 U4.18 77.5,57.15 76.89,57.15 76.58,57.45 76.58,59.36 78.33,61.11 85.88,61.11 85.95,61.19 | 78.64,54.48 78.64,54.86 78.33,55.17 | 85.5,49.84 85.95,50.29 85.95,54.18 85.65,54.48 84.96,54.48 U4.7 84.81,54.48 78.64,54.48 | 85.5,49.84 81.69,46.02 73.46,46.02 R33.2 | TP1.TP 9.53,67.21 10.67,67.21 12.12,68.66 27.89,68.66 31.24,72.01 C9.- 31.39,72.16 35.2,72.16 40.16,77.11 52.12,77.11 53.19,78.18 JP24.2 | U1.24 33.83,14.17 33.83,14.78 U1.25 | 28.8,13.79 28.8,8.69 28.5,8.38 28.04,8.38 U1.14 | 28.8,13.79 28.5,14.1 28.04,14.1 U1.5 28.04,14.25 28.04,14.71 U1.4 27.96,14.86 27.96,15.39 U1.3 27.96,15.54 27.96,16 U1.2 27.96,16.15 27.96,16.69 U1.1 28.12,16.84 29.79,18.52 29.79,19.05 C1.2 29.95,19.2 29.95,25.91 34.29,30.25 34.29,30.48 JP26.4 34.37,30.63 34.37,30.79 37.03,33.45 37.03,39.62 39.78,42.37 50.44,42.37 51.36,43.28 C19.- 51.51,43.43 51.51,44.73 54.41,47.62 C2.2 54.41,47.85 54.41,48.01 55.55,49.15 55.55,51.59 56.03,52.07 56.24,52.27
  Top 0.305: 28.8,13.79 29.18,14.17 33.68,14.17 U1.24 | JP23.4 27.51,4.12 27.74,4.12 29.87,6.25 33.38,6.25 34.98,7.85 34.98,13.49 34.29,14.17 33.98,14.17 U1.24 | U10.2 60.88,42.44 60.35,41.91 56.62,41.91 56.39,42.14 R34.1 56.24,42.29 56.24,42.82 55.02,44.04 55.02,45.95 58.29,49.23 58.29,50.98 U2.13 58.29,51.21 58.29,51.44 58.12,51.61 57.92,51.8 57.68,52.05 57.45,52.05 56.68,52.05 56.46,52.05 56.24,52.27 | 56.24,52.27 55.32,53.19 55.32,56.01 54.41,56.92 54.41,57.15 C7.2
  Bottom 0.305: JP25.CASE1 98.07,78.64 97.16,79.55 89.15,79.55 88.54,78.94 88.54,78.87 88.16,78.49 JP25.CASE4 88.09,78.33 88.09,71.25 84.12,67.28 83.9,67.28 JP25.CASE3 | C12.2 82.07,51.89 80.16,53.8 80.16,55.32 C11.2 80.31,55.32 87.71,55.32 89.69,57.3 C13.- | JP25.CASE3 83.74,67.28 83.74,63.4 C13.- | JP25.CASE2 98.53,64.85 97.99,64.85 90.22,57.07 C13.- | 67.13,26.9 65,26.9 C14.2 | 67.13,26.9 69.19,28.96 C15.1 69.11,29.11 68.66,29.57 68.66,31.62 U5.1 | R18.1 67.82,4.65 v67.82,7.16 69.8,9.14 v69.8,15.54 67.21,18.14 67.21,24.08 | 67.21,24.08 67.21,26.82 67.13,26.9 | v94.34,28.42 94.34,25.98 | 94.34,25.98 v94.34,25.53 | 67.21,24.08 80.16,24.08 82.07,25.98 94.34,25.98 | C18.2 43.74,68.28 42.52,69.49 41.22,69.49 C33.2 41.22,69.34 41.22,65.99 U11.28 41.38,65.91 42.82,65.91 43.13,65.61 43.13,62.41 42.75,62.03 41.45,62.03 U11.22 41.3,62.03 41.3,61.57 U11.21 41.22,61.42 40.54,61.42 40.16,61.04 40.16,60.05 39.32,59.21 37.95,59.21 37.19,59.97 36.96,59.97 C32.2 36.88,60.12 36.88,60.5 29.03,68.35 C8.2 29.03,68.5 29.03,69.8 31.24,72.01 C9.- 31.24,72.16 29.03,74.37 29.03,77.11 IC2.GND | JP23.4 32.31,8.91 32.31,11.2 R5.1 | 59.05,76.89 60.2,78.03 JP27.2 60.35,78.11 60.5,78.11 62.33,79.93 69.34,79.93 71.32,77.95 JP30.2 71.48,77.95 71.48,75.21 69.04,72.77 69.04,72.31 U9.11 | 59.05,76.89 58.52,76.35 58.52,74.52 U6.8 | 59.05,76.89 56.62,79.32 54.86,79.32 53.8,78.26 53.19,78.26 JP24.2 | U9.11 68.96,72.16 67.97,72.16 60.96,65.15 60.96,63.32 57.61,59.97 57.15,59.97 U8.11 57.07,59.82 57.07,50.44 51.51,44.88 51.51,43.43 C19.- | JP25.CASE3 83.59,67.36 74.14,67.36 70.1,71.4 69.34,71.4 68.96,71.78 68.96,72.01 U9.11
  pour Bottom (isolate 0.305): 74.66,0 74.64,45.87 89.67,45.87 89.67,0 100,0 100,80.55 35.59,80.55 35.59,73.39 44.91,73.39 55.12,63.18 55.12,58.67 50.45,54 50.45,46.04 47.52,46.04 47.52,39.5 62.5,39.5 62.5,0
  pour Bottom (isolate 0.305): 37.5,0 37.5,39.46 32.83,39.46 32.83,43.97 25.4,43.97 25.4,0
  pour Top (isolate 0.305): 74.66,0.02 74.64,45.89 89.67,45.89 89.67,0.02 100,0 100,80.55 35.59,80.55 35.59,73.41 44.91,73.41 55.12,63.2 55.12,58.69 50.45,54.03 50.45,46.07 47.52,46.07 47.52,39.52 62.5,39.52 62.5,0.02
  pour Top (isolate 0.305): 37.5,0 37.5,39.46 32.83,39.46 32.83,43.97 25.4,43.97 25.4,0
GND  (via drill 0.46)
  Top 0.914: JP12.1 JP13.1 JP14.1 JP15.1 JP16.1 JP17.1 JP18.1 JP19.1 JP20.1 JP21.1 JP22.1 | C5.- 12.27,71.63 4.04,63.4 4.04,61.49 X1.1 4.19,61.04 4.19,59.21 12.5,50.9 12.5,43.59 JP1.1 12.65,43.13 12.65,39.85 JP2.1 12.72,39.32 12.72,35.97 JP3.1 12.65,35.51 12.65,32.23 JP4.1 12.72,31.7 12.72,28.35 JP5.1 12.65,27.89 12.65,24.61 JP6.1 12.72,24.08 12.72,20.73 JP7.1 12.65,20.27 12.65,16.99 JP8.1 12.72,16.46 12.72,13.11 JP9.1 12.65,12.65 12.65,9.37 JP10.1 12.72,8.84 12.72,5.11 JP11.1 | v91.36,56.08 91.36,61.11 82.14,70.33 71.63,70.33 v66.98,74.98 | v64.77,75.51 39.7,75.51 29.11,64.92 C4.-
  Bottom 0.914: C3.2 22.25,66.83 21.57,66.14 19.05,66.14 I2.P$3 18.75,66.45 13.72,71.48 12.72,71.48 C5.- 10.52,73.46 6.78,73.46 C6.2 | C3.2 22.25,67.36 22.25,69.88 21.41,70.71 IC1.GND | C4.- 29.03,64.92 24.08,64.92 23.16,65.84 23.09,65.84 22.48,66.45 C3.2 | JP22.1 87.63,52.35 v91.36,56.08 | v66.98,74.98 66.45,75.51 v64.77,75.51
  pour Top (isolate 0.305): 0,37.13 0,80.55 34.75,80.55 34.75,73.37 31.31,73.37 31.31,61.95 24,61.95 24,65.1 9.07,65.1 9.07,49.42 5.93,46.28 5.93,37.2 0.07,37.2
  pour Bottom (isolate 0.305): 0,80.55 34.72,80.55 34.72,73.35 31.28,73.35 31.28,61.92 23.97,61.92 23.97,65.07 9.04,65.07 9.04,49.4 5.9,46.25 5.9,37.17 0.05,37.17
  pour Bottom (isolate 0.305, no thermals): 11.13,0 11.13,45.21 24.76,45.21 24.76,0 11.16,0
  pour Top (isolate 0.305, no thermals): 11.13,0 11.13,45.21 24.76,45.21 24.76,0 11.16,0
  pour Top (isolate 0.305, no thermals): 88.99,0 88.99,45.09 75.62,45.09 75.62,-0.08 88.83,-0.08
I2S_BCK
  Bottom 0.152: U8.15 57.07,62.56 52.58,62.56 50.52,64.62 48.54,64.62 U11.3
I2S_LRCK  (via drill 0.3)
  Top 0.152: v52.73,63.17 49.84,63.17 v49.76,63.25
  Bottom 0.152: v52.73,63.17 57.07,63.17 U8.16 | v49.76,63.25 48.62,63.25 48.54,63.32 U11.5 48.46,63.32 47.85,63.32 47.55,63.02 47.55,62.41 47.85,62.1 48.46,62.1 U11.7
I2S_RXD
  Bottom 0.152: U8.14 57.07,61.87 52.81,61.87 51.97,62.71 U11.6
I2S_TXD  (via drill 0.3)
  Top 0.152: v50.29,63.86 v52.05,63.86
  Bottom 0.152: v52.05,63.86 57.07,63.86 U8.17 | v50.29,63.86 48.69,63.86 48.54,64.01 U11.4
LCD_DC  (via drill 0.3)
  Top 0.152: v64.62,55.17 64.54,55.17 63.93,54.56 63.93,53.8 U2.42 | v64.08,56.16 63.17,56.16 56.77,62.56 56.77,67.67 56.46,67.97 54.1,67.97 v54.03,67.89
  Bottom 0.152: v64.62,55.17 64.62,55.63 v64.08,56.16 | v54.03,67.89 53.11,67.89 52.2,68.81 U6.14
LCD_RST  (via drill 0.3)
  Top 0.152: v62.26,54.86 62.26,53.8 U2.34 | v61.8,56.62 61.8,57.07 56.24,62.64 v56.24,67.44
  Bottom 0.152: v62.26,54.86 62.26,55.24 61.8,55.7 v61.8,56.62 | v56.24,67.44 56.24,68.58 56.01,68.81 U6.11
LLINEIN  (via drill 0.3)
  Top 0.152: v42.52,60.73 40.54,60.73 32.38,52.58 32.38,52.43 v29.49,49.53
  Bottom 0.152: v42.52,60.73 41.3,60.73 U11.20 | v29.49,49.53 28.27,49.53 19.89,41.15 10.9,41.15 2.59,32.84 C30.+
N$1
  Top 0.152: R1.2 20.57,43.2 17.83,43.2 JP1.3
N$2
  Top 0.152: X1.2 4.04,66.52 5.87,66.52 16.46,77.11 20.12,77.11 D1.A
N$3
  Top 0.152: R6.2 20.57,39.4 17.83,39.4 JP2.3
N$4  (via drill 0.3)
  Top 0.152: v31.77,13.49 33.76,13.49 U1.23
  Bottom 0.152: v31.77,13.49 29.57,11.28 R5.2
N$5
  Top 0.152: R10.2 20.57,35.59 17.83,35.59 JP3.3
N$6  (via drill 0.3)
  Top 0.152: v64.24,10.36 64.85,10.97 65.23,10.97 U3.23
  Bottom 0.152: v64.24,10.36 64.24,5.33 64.92,4.65 R18.2
N$7
  Top 0.152: R14.2 20.57,31.77 17.83,31.77 JP4.3
N$8
  Top 0.152: X4.3 95.71,41.68 95.71,42.22 X4.2 95.63,42.29 95.1,42.29 86.33,51.05 86.33,58.9 85.72,59.51 78.18,59.51 77.72,59.05 U4.15 77.65,59.05 77.65,58.45 U4.16
N$9
  Top 0.152: R16.2 20.57,27.96 17.83,27.96 JP5.3
N$10
  Bottom 0.152: 66.1,35.4 67.36,36.65 67.36,36.8 U5.7 67.44,36.88 68.58,36.88 U5.8 68.58,36.96 68.73,37.11 68.73,40.08 R25.2 | 66.1,35.4 64.31,33.6 64.31,30.71 64.92,30.1 64.92,28.57 C14.1 | 66.1,35.4 65.53,35.97 65.53,37.64 63.32,39.85 37.34,39.85 37.11,39.62 37.11,38.71 35.51,37.11 33.68,37.11 32.54,35.97 32.54,34.44 28.65,30.56 28.65,29.87 R36.2
N$11
  Top 0.152: R19.2 20.57,24.16 17.83,24.16 JP6.3
N$12  (via drill 0.3)
  Top 0.152: v71.63,51.36 69.95,49.68 66.98,49.68 66.29,50.37 66.29,51.13 U2.53 | v77.27,61.34 79.17,63.25 79.17,65.84 75.36,69.65 68.28,69.65 65,72.92 64.54,72.92 62.64,71.02 v62.64,70.87
  Bottom 0.152: v71.63,51.36 71.63,54.25 77.27,59.89 v77.27,61.34 | v62.64,70.87 60.5,70.87 U6.9
N$13
  Top 0.152: R21.2 20.57,20.34 17.83,20.34 JP7.3
N$14  (via drill 0.3)
  Top 0.152: v71.09,53.65 71.09,51.28 69.8,49.99 67.13,49.99 66.67,50.44 U2.55 | v76.5,61.34 78.49,63.32 78.79,63.32 78.87,63.4 78.87,65.68 75.21,69.34 67.82,69.34 v64.77,72.39
  Bottom 0.152: v71.09,53.65 71.09,54.18 76.5,59.59 v76.5,61.34 | v64.77,72.39 63.7,73.46 63.7,74.98 63.55,75.13 60.43,75.13 58.9,73.61 58.14,73.61 57.3,74.45 U6.7
N$15
  Top 0.152: R23.2 20.57,16.54 17.83,16.54 JP8.3
N$16
  Bottom 0.152: U6.15 50.83,68.89 50.22,69.49 50.22,69.57 42.9,76.89 39.24,76.89 37.95,78.18 JP24.8
N$17
  Top 0.152: R2.2 20.57,12.72 17.83,12.72 JP9.3
N$18
  Top 0.152: R7.2 20.57,8.91 17.83,8.91 JP10.3
N$19
  Top 0.152: R11.2 20.57,5.11 17.83,5.11 JP11.3
N$20
  Top 0.152: R4.2 79.7,35.59 82.53,35.59 JP20.3
N$21
  Top 0.152: R9.2 79.7,39.4 82.53,39.4 JP21.3
N$22
  Top 0.152: R13.2 79.7,43.2 82.53,43.2 JP22.3
N$23
  Bottom 0.152: U6.12 54.63,68.89 54.03,69.49 54.03,69.57 51.51,72.08 48.16,72.08 43.05,77.19 41.53,77.19 40.54,78.18 JP24.7
N$24
  Bottom 0.152: U6.10 57.23,68.89 53.72,72.39 48.84,72.39 43.05,78.18 JP24.6
N$25
  Bottom 0.152: U6.6 55.93,74.52 53.26,77.19 52.81,77.19 51.97,78.03 51.97,78.79 51.21,79.55 46.86,79.55 45.57,78.26 JP24.5
N$26
  Top 0.152: R3.2 79.7,5.11 82.53,5.11 JP12.3
N$27
  Top 0.152: R8.2 79.7,8.91 82.53,8.91 JP13.3
N$28
  Top 0.152: R12.2 79.7,12.72 82.53,12.72 JP14.3
N$29
  Top 0.152: R15.2 79.7,16.54 82.53,16.54 JP15.3
N$30
  Top 0.152: R17.2 79.7,20.34 82.53,20.34 JP16.3
N$31
  Top 0.152: R20.2 79.7,24.16 82.53,24.16 JP17.3
N$32
  Top 0.152: R22.2 79.7,27.96 82.53,27.96 JP18.3
N$33
  Top 0.152: R24.2 79.7,31.77 82.53,31.77 JP19.3
N$34
  Bottom 0.152: U6.4 53.42,74.52 53.42,76.12 51.66,77.88 51.66,78.64 51.05,79.25 49.15,79.25 48.16,78.26 JP24.4
N$35
  Bottom 0.152: U8.12 57.15,60.58 57.45,60.58 60.58,63.7 60.58,66.83 65.38,71.63 65.38,73.84 R37.1 65.38,73.91 62.79,76.5 62.79,78.03 JP27.1
N$36
  pour Bottom (isolate 0.305, no thermals): 88.99,0 88.99,45.09 75.62,45.09 75.62,-0.08 88.83,-0.08
N$37  (via drill 0.3)
  Top 0.152: v74.75,65.38 74.75,60.12 69.11,54.48 69.11,53.8 U2.68
  Bottom 0.152: v74.75,65.38 74.75,66.37 U9.1
N$38
  Bottom 0.152: R40.1 41.22,43.59 38.1,43.59 37.95,43.43 C17.+
N$39  (via drill 0.3)
  Top 0.152: v70.48,53.03 70.48,51.13 69.65,50.29 67.28,50.29 67.13,50.44 67.13,51.13 U2.57 | v75.89,62.71 75.89,65.46 73.3,68.05 60.58,68.05 v55.24,73.38
  Bottom 0.152: v70.48,53.03 70.48,54.03 75.89,59.44 v75.89,62.71 | v55.24,73.38 55.24,73.91 54.71,74.45 U6.5
N$40  (via drill 0.3)
  Top 0.152: v73.46,60.35 68.28,55.17 68.28,53.8 U2.64
  Bottom 0.152: v73.46,60.35 73.46,66.37 U9.3
N$41  (via drill 0.3)
  Top 0.152: v72.85,57.15 69.49,53.8 U2.70
  Bottom 0.152: v72.85,57.15 72.85,66.37 U9.4
N$42  (via drill 0.3)
  Top 0.152: v72.16,58.29 72.16,57.99 68.73,54.56 68.73,53.8 U2.66
  Bottom 0.152: v72.16,58.29 72.16,66.37 U9.5
N$43  (via drill 0.3)
  Top 0.152: v71.55,59.21 71.55,58.9 67.89,55.24 67.89,53.8 U2.62
  Bottom 0.152: v71.55,59.21 71.55,66.37 U9.6
N$44  (via drill 0.3)
  Top 0.152: v70.26,58.37 70.26,58.06 67.13,54.94 67.13,53.8 U2.58
  Bottom 0.152: v70.26,58.37 70.26,66.37 U9.8
N$45  (via drill 0.3)
  Top 0.152: v66.67,60.43 66.67,57.53 65.08,55.93 65.08,55.47 65.15,55.4 65.15,54.94 64.85,54.63 64.47,54.63 64.31,54.48 64.31,53.8 U2.44
  Bottom 0.152: v66.67,60.43 69.57,63.32 69.57,66.37 U9.9
N$46
  Bottom 0.152: SJ1.2 51.21,60.2 51.44,60.2 52.2,59.44 52.2,57.99 44.96,50.75 44.96,48.01 45.19,47.78 45.19,45.72 45.03,45.57 43.2,45.57 42.37,46.41 42.37,47.7 38.56,51.51 28.96,51.51 26.29,48.84 C26.+
N$47
  Bottom 0.152: R26.1 16.15,54.33 16.15,52.43 17.83,50.75 R27.1 17.91,50.67 18.29,50.67 20.12,48.84 20.12,47.78 20.5,47.4 21.72,47.4 23.09,48.77 24.16,48.77 C26.-
N$48
  Bottom 0.152: R28.1 21.11,48.23 21.11,51.66 21.26,51.82 U7.3
N$50
  Bottom 0.152: R29.2 25.68,53.49 23.16,53.49 22.63,52.96 20.95,52.96 20.65,52.65 20.65,51.89 U7.4
N$52
  Bottom 0.152: R28.2 19.36,48.23 14.4,48.23 11.89,50.75 C28.2
N$53
  Bottom 0.152: R29.1 25.68,55.32 25.68,56.39 24,58.06 C29.1
N$54
  Bottom 0.152: C27.2 11.66,52.65 11.81,52.5 C28.1 11.89,52.43 13.56,50.75 15.01,50.75 R27.2
N$55
  Bottom 0.152: JP28.1 20.65,62.48 20.65,56.08 U7.5
N$56
  Bottom 0.152: JP28.2 19.13,62.03 19.13,56.24 20.34,55.02 22.25,55.02 22.55,55.32 22.55,56.01 U7.8
N$59
  Bottom 0.152: R41.1 6.71,10.97 6.71,9.6 9.37,6.93 X3.3
N$60
  Bottom 0.152: R42.1 6.93,5.41 6.93,4.8 9.37,2.36 X3.2
N$61
  Bottom 0.152: R42.2 4.04,5.49 4.04,11.12 R43.2 4.04,11.2 4.04,12.04 0.84,15.24 0.84,23.32 1.6,24.08 C36.1 1.68,24.16 1.68,29.87 2.52,30.71 C30.-
N$63
  Bottom 0.152: 7.58,27.85 9.07,26.36 R44.2 9.14,26.29 10.21,25.22 10.21,22.55 9.6,21.95 9.6,11.05 R41.2 | 7.58,27.85 7.54,27.89 6.1,27.89 C31.1 | 7.58,27.85 8.08,28.35 8.08,31.77 C25.-
N$64  (via drill 0.3)
  Top 0.152: v60.81,68.58 73.84,68.58 77.8,64.62 R31.1
  Bottom 0.152: v60.81,68.58 57.99,65.76 57.15,65.76 U8.20
N$65
  Top 0.152: LED1.A 84.12,64.62 80.7,64.62 R31.2
N$66  (via drill 0.3)
  Top 0.152: v62.1,69.11 62.1,71.09 68.96,77.95 JP30.1
  Bottom 0.152: v62.1,69.11 57.45,64.47 57.15,64.47 U8.18
N$67
  Bottom 0.152: Q2.2 35.66,68.96 36.2,69.49 39.47,69.49 C33.1 39.47,69.42 39.47,65.84 40.62,64.69 41.22,64.69 U11.26
N$68
  Top 0.152: U10.5 60.88,44.81 60.35,44.27 57.07,44.27 56.39,44.96 R34.2
N$69
  Bottom 0.152: 38.14,61.61 35.66,64.08 Q2.1 | 38.14,61.61 38.56,61.19 38.56,60.05 C32.1 | 38.14,61.61 40.54,64.01 41.22,64.01 U11.25
N$70
  Bottom 0.152: C34.2 33.68,58.67 35.43,58.67 37.57,56.54 C35.+ 37.57,56.62 39.09,58.14 41.22,58.14 U11.16
N$72
  Bottom 0.152: U11.17 41.3,58.75 41.99,58.75 44.12,56.62 44.12,46.79 R35.2
N$73  (via drill 0.3)
  Top 0.152: v45.49,50.37 v44.65,51.21
  Bottom 0.152: v44.65,51.21 44.65,56.77 41.99,59.44 41.3,59.44 U11.18 | v45.49,50.37 45.49,45.03 44.12,43.66 R40.2
N$74
  Bottom 0.152: R39.2 29.18,46.79 32.99,46.79 33.15,46.63 C24.1 33.22,46.56 34.29,46.56 35.93,44.92 | JP32.2 37.83,46.83 | 37.83,46.83 37.87,46.79 41.22,46.79 R35.1 | 37.83,46.83 35.93,44.92 | 35.93,44.92 35.89,44.88 35.89,43.43 C17.-
RLINEIN  (via drill 0.3)
  Top 0.152: v42.52,59.97 42.29,59.97 37.72,55.4 37.19,55.4 30.18,48.39 v30.18,47.93
  Bottom 0.152: v42.52,59.97 42.37,60.12 41.3,60.12 U11.19 | v30.18,47.93 29.95,47.93 29.57,47.55 28.19,47.55 17.98,37.34 11.58,37.34 8.15,33.91 C25.+
SD_CD  (via drill 0.3)
  Top 0.152: v75.36,54.18 70.87,54.18 69.65,52.96 67.67,52.96 67.51,53.11 67.51,53.72 U2.60 | v92.28,57.99 92.28,69.42 v84.89,76.81
  Bottom 0.152: v75.36,54.18 76.81,54.18 80.24,50.75 85.04,50.75 v92.28,57.99 | v84.89,76.81 84.2,77.5 83.82,77.5 JP25.CC1
SD_CLK  (via drill 0.3)
  Top 0.152: v74.91,73.23 74.75,73.23 74.37,72.85 71.32,72.85 v70.94,73.23
  Bottom 0.152: U9.12 69.65,72.24 70.26,72.24 U9.13 70.26,72.31 70.26,72.54 v70.94,73.23 | v74.91,73.23 83.74,73.23 JP25.5
SD_CMD  (via drill 0.3)
  Top 0.152: v82.75,71.25 v72.08,71.25
  Bottom 0.152: v72.08,71.25 71.63,71.7 71.63,72.16 U9.15 | v82.75,71.25 83.59,71.25 83.74,71.09 JP25.3
SD_DAT0
  Bottom 0.152: U9.16 72.24,72.16 72.24,71.86 75.82,68.28 84.51,68.28 84.66,68.43 84.66,74.83 84.05,75.44 83.82,75.44 JP25.7
SD_DAT1
  Bottom 0.152: U9.17 72.92,72.24 72.92,72.92 76.5,76.5 83.74,76.5 JP25.8
SD_DAT2
  Bottom 0.152: U9.18 73.53,72.16 73.53,71.86 76.5,68.89 83.74,68.89 JP25.1
SD_DAT3
  Bottom 0.152: U9.20 74.83,72.16 81.08,72.16 83.21,70.03 83.74,70.03 JP25.2
SHUTDOWN  (via drill 0.3)
  Top 0.152: v37.34,53.19 v48.16,53.19
  Bottom 0.152: v48.16,53.19 56.16,61.19 57.07,61.19 U8.13 | v37.34,53.19 33.15,53.19 31.85,51.89 22.63,51.89 U7.1
UART_RXD  (via drill 0.3)
  Top 0.152: v59.89,54.86 59.89,53.8 U2.22 | v62.41,59.28 62.41,62.48 66.45,66.52 74.37,66.52 75.36,65.53 v75.36,56.08 | v79.25,52.58 83.74,52.58 84.35,53.19 84.89,53.19 U4.5
  Bottom 0.152: v59.89,54.86 59.89,57 62.18,59.28 v62.41,59.28 | v75.36,56.08 78.87,52.58 v79.25,52.58
UART_TXD
  Top 0.152: U2.27 61.11,51.13 61.11,50.44 63.25,48.31 82.6,48.31 84.89,50.6 U4.1
USB_DN  (via drill 0.3)
  Top 0.152: v58.75,52.73 59.05,53.03 59.05,53.72 U2.18 | v68.96,41.22 70.41,39.78 70.41,39.7 70.94,39.17 71.63,39.17 75.51,43.05 75.51,44.42 76.35,45.26 88.24,45.26 91.97,41.53 91.97,29.11 94.64,26.44 95.48,26.44 X2.3
  Bottom 0.152: v58.75,52.73 59.05,52.73 59.28,52.96 59.74,52.96 63.02,49.68 63.02,47.17 v68.96,41.22
USB_DP  (via drill 0.3)
  Top 0.152: v68.05,56.62 68.05,65.23 67.06,66.22 66.6,66.22 66.14,65.76 66.14,57.45 64.08,55.4 59.66,55.4 58.67,54.41 58.67,53.8 U2.16 | v92.51,36.73 92.51,29.03 94.41,27.13 95.48,27.13 X2.2
  Bottom 0.152: v68.05,56.62 68.05,54.18 81.08,41.15 88.09,41.15 v92.51,36.73
USB_FAULT  (via drill 0.3)
  Top 0.152: U10.4 61.8,45.03 v61.8,45.95 61.8,48.16 59.51,50.44 59.51,51.13 U2.19 | v62.94,45.72 64.39,44.27 R32.1
  Bottom 0.152: v62.94,45.72 62.03,45.72 v61.8,45.95
USB_ID
  Top 0.152: U2.3 56.24,51.13 56.24,47.78 54.63,46.18 54.63,41.76 55.24,41.15 61.42,41.15 63.25,42.98 65.3,42.98 66.22,43.89 66.22,45.41 66.29,45.49 68.2,45.49 68.35,45.34 68.35,41 67.82,40.46 67.82,39.78 68.73,38.86 71.78,38.86 75.82,42.9 75.82,44.27 76.5,44.96 88.09,44.96 91.67,41.38 91.67,28.96 94.87,25.76 95.48,25.76 X2.4
USB_PSW
  Top 0.152: 62.41,47.93 62.41,48.01 59.89,50.52 59.89,51.13 U2.21 | 62.41,47.93 62.41,44.42 61.87,43.89 61.87,42.75 U10.3 | 62.41,47.93 68.96,47.93 70.87,46.02 71.63,46.02 R33.1
USB_VBUS  (via drill 0.3)
  Top 0.152: X2.1 95.48,27.74 94.26,27.74 93.5,28.5 93.5,32.23 C16.1 93.42,32.31 93.42,32.92 v93.04,33.3 | v59.89,49.3 59.89,45.03 U10.6 | v59.51,52.43 59.51,53.72 U2.20 | v66.37,46.33 63.09,46.33 v62.94,46.48
  Bottom 0.152: v59.51,52.43 59.89,52.05 v59.89,49.3 62.71,46.48 v62.94,46.48 | v93.04,33.3 92.13,33.3 87.86,37.57 75.13,37.57 v66.37,46.33
V+  (via drill 0.46)
  Top 0.914: JP12.2 85.11,5.11 85.11,8.84 JP13.2 85.04,9.37 85.04,12.65 JP14.2 85.11,13.11 85.11,16.46 JP15.2 85.04,16.99 85.04,20.27 JP16.2 85.11,20.73 85.11,24.08 JP17.2 85.04,24.61 85.04,27.89 JP18.2 85.11,28.35 85.11,31.7 JP19.2 85.04,32.23 85.04,35.51 JP20.2 85.11,35.97 85.11,39.32 JP21.2 85.04,39.85 85.04,43.13 JP22.2 | JP11.2 JP10.2 JP9.2 JP8.2 JP7.2 JP6.2 JP5.2 JP4.2 JP3.2 JP2.2 JP1.2 15.47,43.59 17.22,45.34 24,45.34 v27.58,41.76 | v81.15,42.06 81.15,41.91 v80.24,41 | v73.84,39.93 72.08,38.18 68.05,38.18 v67.97,38.25
  Bottom 0.914: JP1.2 15.24,43.36 13.26,45.34 12.12,45.34 7.16,40.39 2.97,40.39 S1.1 | v81.15,42.06 81.15,44.5 81.99,45.34 83.13,45.34 85.04,43.43 85.04,43.2 JP22.2 | v80.24,41 74.91,41 v73.84,39.93 | v67.97,38.25 64.69,41.53 62.26,41.53 62.03,41.76 v27.58,41.76
VBUS  (via drill 0.3)
  Top 0.152: X4.1 95.63,42.98 95.33,42.98 88.09,50.22 88.09,57 C13.+ | v76.43,55.78 77.57,55.78 U4.20
  Bottom 0.152: 79.4,55.78 79.4,56.01 79.63,56.24 87.25,56.24 88.01,57 C13.+ | 79.4,55.78 79.4,53.19 81.53,51.05 82.75,51.05 82.91,51.21 82.91,52.5 82.14,53.26 82.14,53.49 C12.1 | 79.4,55.78 v76.43,55.78
VCC
  Top 0.914: C5.+ 13.41,70.71 18.82,70.71 IC1.IN 19.05,71.17 24.99,77.11 26.44,77.11 IC2.IN
  Bottom 0.914: D1.C 4.95,77.11 5.03,77.04 5.03,73.53 C6.1 5.18,73.08 10.06,68.2 10.29,68.2 10.67,67.97 | 10.67,67.97 10.67,66.67 9.53,65.53 9.53,64.62 TP4.TP 9.53,64.16 9.53,49.15 3.35,42.98 2.97,42.98 S1.2 | C5.+ 10.67,67.97

## Text on the board
tNames: Axion 0.9 for | DGND | AGND | +5V | +7.2V | AVCC | DVCC | Intel Edison | SERIAL | SCL | SDA | OTG | 方向厳守 | v0.9.2 2016/11/6